# Altium schematic sheet SCH_Incense.SchDoc
size B
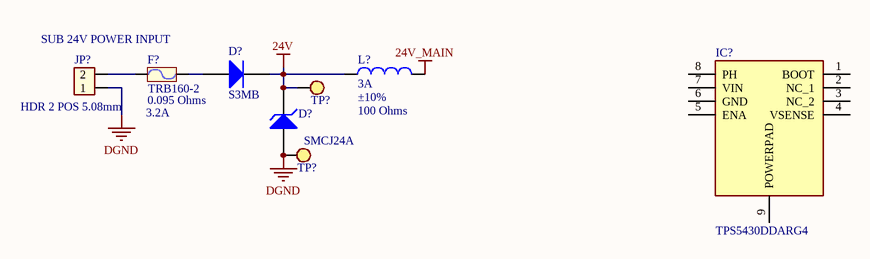
[diagram p0: SCH_Incense.SchDoc]

## Parts
(Parts that share a designator on the sheet are numbered #1, #2 ... from top to bottom, then left to right.)
D?#1  S3MB  [DO-214AB]
D?#2  SMCJ24A  [DO-214AB]
F?  DC Cold Resistance: 0.095 Ohms  Current Rating (Amps): 3.2A  [TRB160-2]  (hidden comment: TRB160-2)
IC?  TPS5430DDARG4  [SOIC127P600X170-9N]
JP?  HDR 2 POS 5.08mm  [010321021]
L?  value 100 Ohms  Current: 3A  Tolerance: ±10%  [FB 0603]  (hidden comment: MPZ1608S101ATAH0)
TP?#1  TP SMD  [TESTPOINT]  (value not drawn)  (no BOM)
TP?#2  TP SMD  [TESTPOINT]  (value not drawn)  (no BOM)

## Nets
24V: D?#1.2(K) D?#2.2(K) L?.1 TP?#1.1
24V_MAIN: L?.2
DGND: D?#2.1(A) JP?.1 TP?#2.1
NetD?#1_1: D?#1.1(A) F?.2
NetF?_1: F?.1 JP?.2

Not connected (* = marked no-connect by the designer): IC? 1(BOOT) 2(NC_1) 3(NC_2) 4(VSENSE) 5(ENA) 6(GND) 7(VIN) 8(PH) 9(POWERPAD)

## Notes on the sheet
- SUB 24V POWER INPUT

## Library data of the parts
D?#1 = Diode: Default Diode; MANUFACTURER1: Diodes; MANUFACTURER1_PART#: S3MB-13-F; Published: 8-Jun-2000; LatestRevisionDate: 17-Jul-2002; LatestRevisionNote: Re-released for DXP Platform.; PackageVersion: Sep-1996; PackageReference: SMC; Publisher: Altium Limited; PackageDescription: DO-214-AB/SMC; 2 C-Bend Leads; Body 7.9 x 5.9 mm, inc. leads (LxW); Code_JEDEC: DO-214-AB; Supplier 1: Future Electronics; Supplier Part Number 1: 2441426
D?#2 = Diode Zener: TVS DIODE 30V 50.82V DO214AB; MANUFACTURER1: Littelfuse Inc.; NI_MARK: NI; LOH_Code: *; Category: DIODE; Value: SMCJ24A; MANUFACTURER1_PART#: SMCJ24A; MANUFACTURER2: *; MANUFACTURER2_PART#: *; Packaging: *
F? = 0875.800MXEP: Polymeric 30V 3.2A 8s 95mO Through Hole,P=5.1mm,L=3.8mm PTC; MANUFACTURER2_PART#: JK30-160; MANUFACTURER1: TLC Electronic; PROCESS_TYPE: MA; Unit: PCS; CATEGORY: FUSE; MANUFACTURER1_PART#: TRB160-2; MANUFACTURER2: Jinrui Electronic Materials Co.; Response Time: 8s; Breaking Capacity @ Rated Voltage: 3.2A; Voltage - Rated: 30V; Value: TRB160-2; Package / Case: TH2
IC? = TPS5430DDARG4: Integrated Circuit; Manufacturer_Name: Texas Instruments; Datasheet Link: http://www.ti.com/general/docs/suppproductinfo.tsp?distId=10&gotoUrl=http%3A%2F%2Fwww.ti.com%2Flit%2Fgpn%2Ftps5431; Height: 1.7mm; Manufacturer_Part_Number: TPS5430DDARG4; Mouser Part Number: 595-TPS5430DDARG4; Mouser Price/Stock: https://www.mouser.co.uk/ProductDetail/Texas-Instruments/TPS5430DDARG4?qs=zwk82MlA57YG4K%2FfUMTveg%3D%3D
JP? = JP2: Conn Wire to Board HDR 2 POS 5.08mm; MANUFACTURER1_PART#: 10321021; MANUFACTURER1: MOLEX; PROCESS_TYPE: TH; CATEGORY: HEADER; VALUE: HDR 2 POS 5.08mm
L? = inductor 2.2uF: FERRITE BEAD 100 OHM 0603 1LN; MANUFACTURER1: TDK Corporation; MANUFACTURER2_PART#: BLM18KG101TN1D; PACKING: Tape & Reel (TR); PCB Footprint: 0603; Process Type: SM; Unit: PCS; Category: Inductor; MANUFACTURER1_PART#: MPZ1608S101ATAH0; MANUFACTURER2: Murata Electronics
TP?#1 TP?#2 = TP SMD: TEST POINT